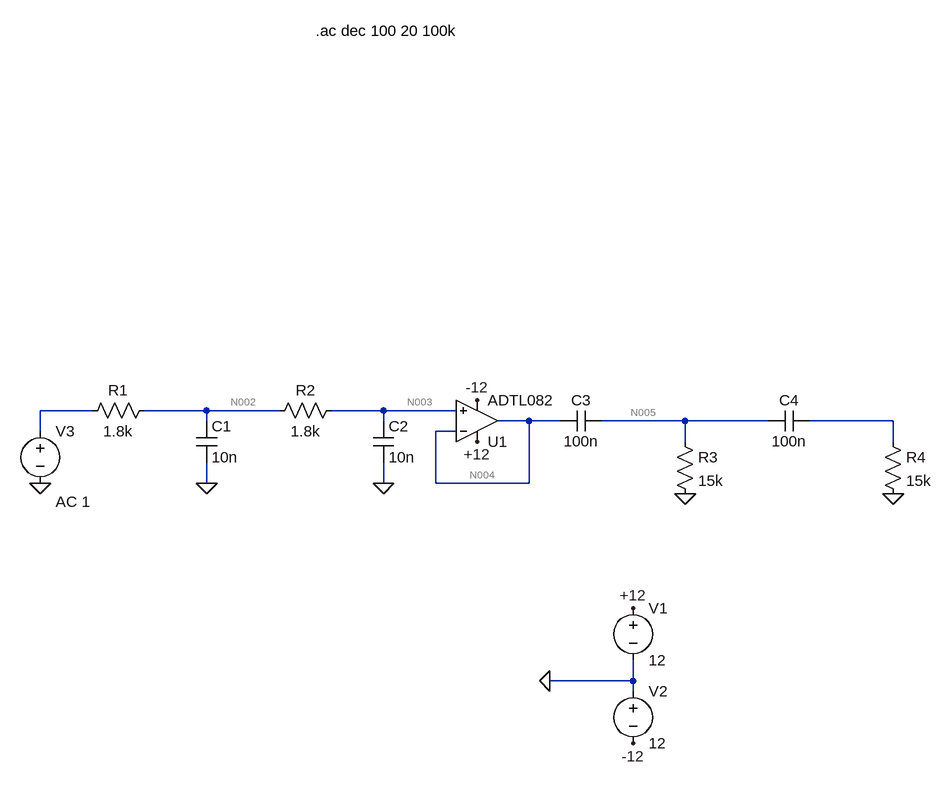
[diagram p0: schematic Draft1.asc]
Draft1.asc, the LTspice schematic file:
Version 4.1
SHEET 1 1420 708
WIRE 32 112 -48 112
WIRE 208 112 112 112
WIRE 320 112 208 112
WIRE 480 112 400 112
WIRE 592 112 480 112
WIRE 208 128 208 112
WIRE 480 128 480 112
WIRE 704 128 656 128
WIRE 752 128 704 128
WIRE 944 128 816 128
WIRE 1072 128 944 128
WIRE 1264 128 1136 128
WIRE -48 144 -48 112
WIRE 592 144 560 144
WIRE 944 160 944 128
WIRE 1264 160 1264 128
WIRE 208 224 208 192
WIRE 480 224 480 192
WIRE 560 224 560 144
WIRE 704 224 704 128
WIRE 704 224 560 224
WIRE 864 528 864 496
WIRE 864 528 736 528
WIRE 864 544 864 528
FLAG 208 224 0
FLAG 480 224 0
FLAG 736 528 0
FLAG 864 416 +12
FLAG 864 624 -12
FLAG 624 96 -12
FLAG 624 160 +12
FLAG 944 240 0
FLAG 1264 240 0
FLAG -48 224 0
SYMBOL res 128 96 R90
WINDOW 0 0 56 VBottom 2
WINDOW 3 32 56 VTop 2
SYMATTR InstName R1
SYMATTR Value 1.8k
SYMBOL res 416 96 R90
WINDOW 0 0 56 VBottom 2
WINDOW 3 32 56 VTop 2
SYMATTR InstName R2
SYMATTR Value 1.8k
SYMBOL cap 192 128 R0
SYMATTR InstName C1
SYMATTR Value 10n
SYMBOL cap 464 128 R0
SYMATTR InstName C2
SYMATTR Value 10n
SYMBOL OpAmps\\ADTL082 624 192 M180
SYMATTR InstName U1
SYMBOL voltage 864 400 R0
WINDOW 123 0 0 Left 0
WINDOW 39 0 0 Left 0
SYMATTR InstName V1
SYMATTR Value 12
SYMBOL voltage 864 528 R0
WINDOW 123 0 0 Left 0
WINDOW 39 0 0 Left 0
SYMATTR InstName V2
SYMATTR Value 12
SYMBOL cap 816 112 R90
WINDOW 0 0 32 VBottom 2
WINDOW 3 32 32 VTop 2
SYMATTR InstName C3
SYMATTR Value 100n
SYMBOL cap 1136 112 R90
WINDOW 0 0 32 VBottom 2
WINDOW 3 32 32 VTop 2
SYMATTR InstName C4
SYMATTR Value 100n
SYMBOL res 928 144 R0
SYMATTR InstName R3
SYMATTR Value 15k
SYMBOL res 1248 144 R0
SYMATTR InstName R4
SYMATTR Value 15k
SYMBOL voltage -48 128 R0
WINDOW 123 24 124 Left 2
WINDOW 39 0 0 Left 0
SYMATTR InstName V3
SYMATTR Value ""
SYMATTR Value2 AC 1
TEXT 376 -472 Left 2 !.ac dec 100 20 100k

The netlist it stands for:
* Draft1.asc
R1 N002 N001 1.8k
R2 N003 N002 1.8k
C1 N002 0 10n
C2 N003 0 10n
X§U1 N003 N004 +12 -12 N004 ADTL082  ; pins In+ In- V+ V- OUT
V1 +12 0 12
V2 0 -12 12
C3 N005 N004 100n
C4 N006 N005 100n
R3 N005 0 15k
R4 N006 0 15k
V3 N001 0 AC 1
.ac dec 100 20 100k
.lib ADI.lib
.backanno
.end

* Results of the author's LTspice run, read from the files saved beside the schematic
* Operating Point, zero values left out:
*   V(+12) = 12 V
*   V(-12) = -12 V
*   I(R1) = -2 pA
*   I(R2) = -2 pA
*   I(V1) = -5.055 mA
*   I(V2) = -5.055 mA
*   I(V3) = -2 pA
*   Ix(u1:1) = 2 pA
*   Ix(u1:2) = 2 pA
*   Ix(u1:3) = 5.055 mA
*   Ix(u1:4) = -5.055 mA
*   Ix(u1:5) = -2 pA
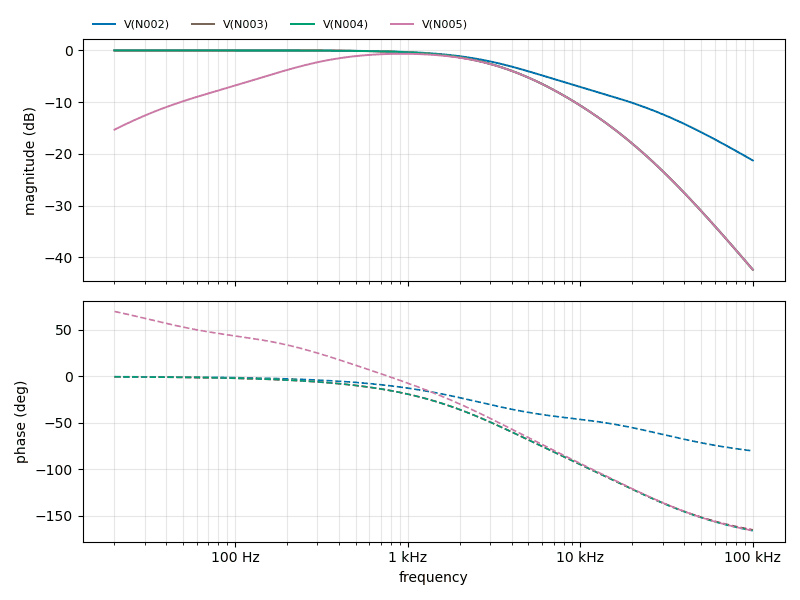
[diagram p1: AC Analysis of Draft1.asc, plotted from the saved traces]
* AC Analysis, 1 run:
*   V(N002): -0.00 dB at 20 Hz, -21.27 dB at 100 kHz, peak -0.00 dB at 20 Hz, 3 dB below the peak at 3.88 kHz
*   V(N003): -0.00 dB at 20 Hz, -42.37 dB at 100 kHz, peak -0.00 dB at 20 Hz, 3 dB below the peak at 3.308 kHz
*   V(N004): -0.00 dB at 20 Hz, -42.37 dB at 100 kHz, peak -0.00 dB at 20 Hz, 3 dB below the peak at 3.308 kHz
*   V(N005): -15.31 dB at 20 Hz, -42.37 dB at 100 kHz, peak -0.65 dB at 935.5 Hz, 3 dB below the peak at 206.1 Hz and 3.776 kHz